# EAGLE design js220_fp_banana (EAGLE 9.6.2)
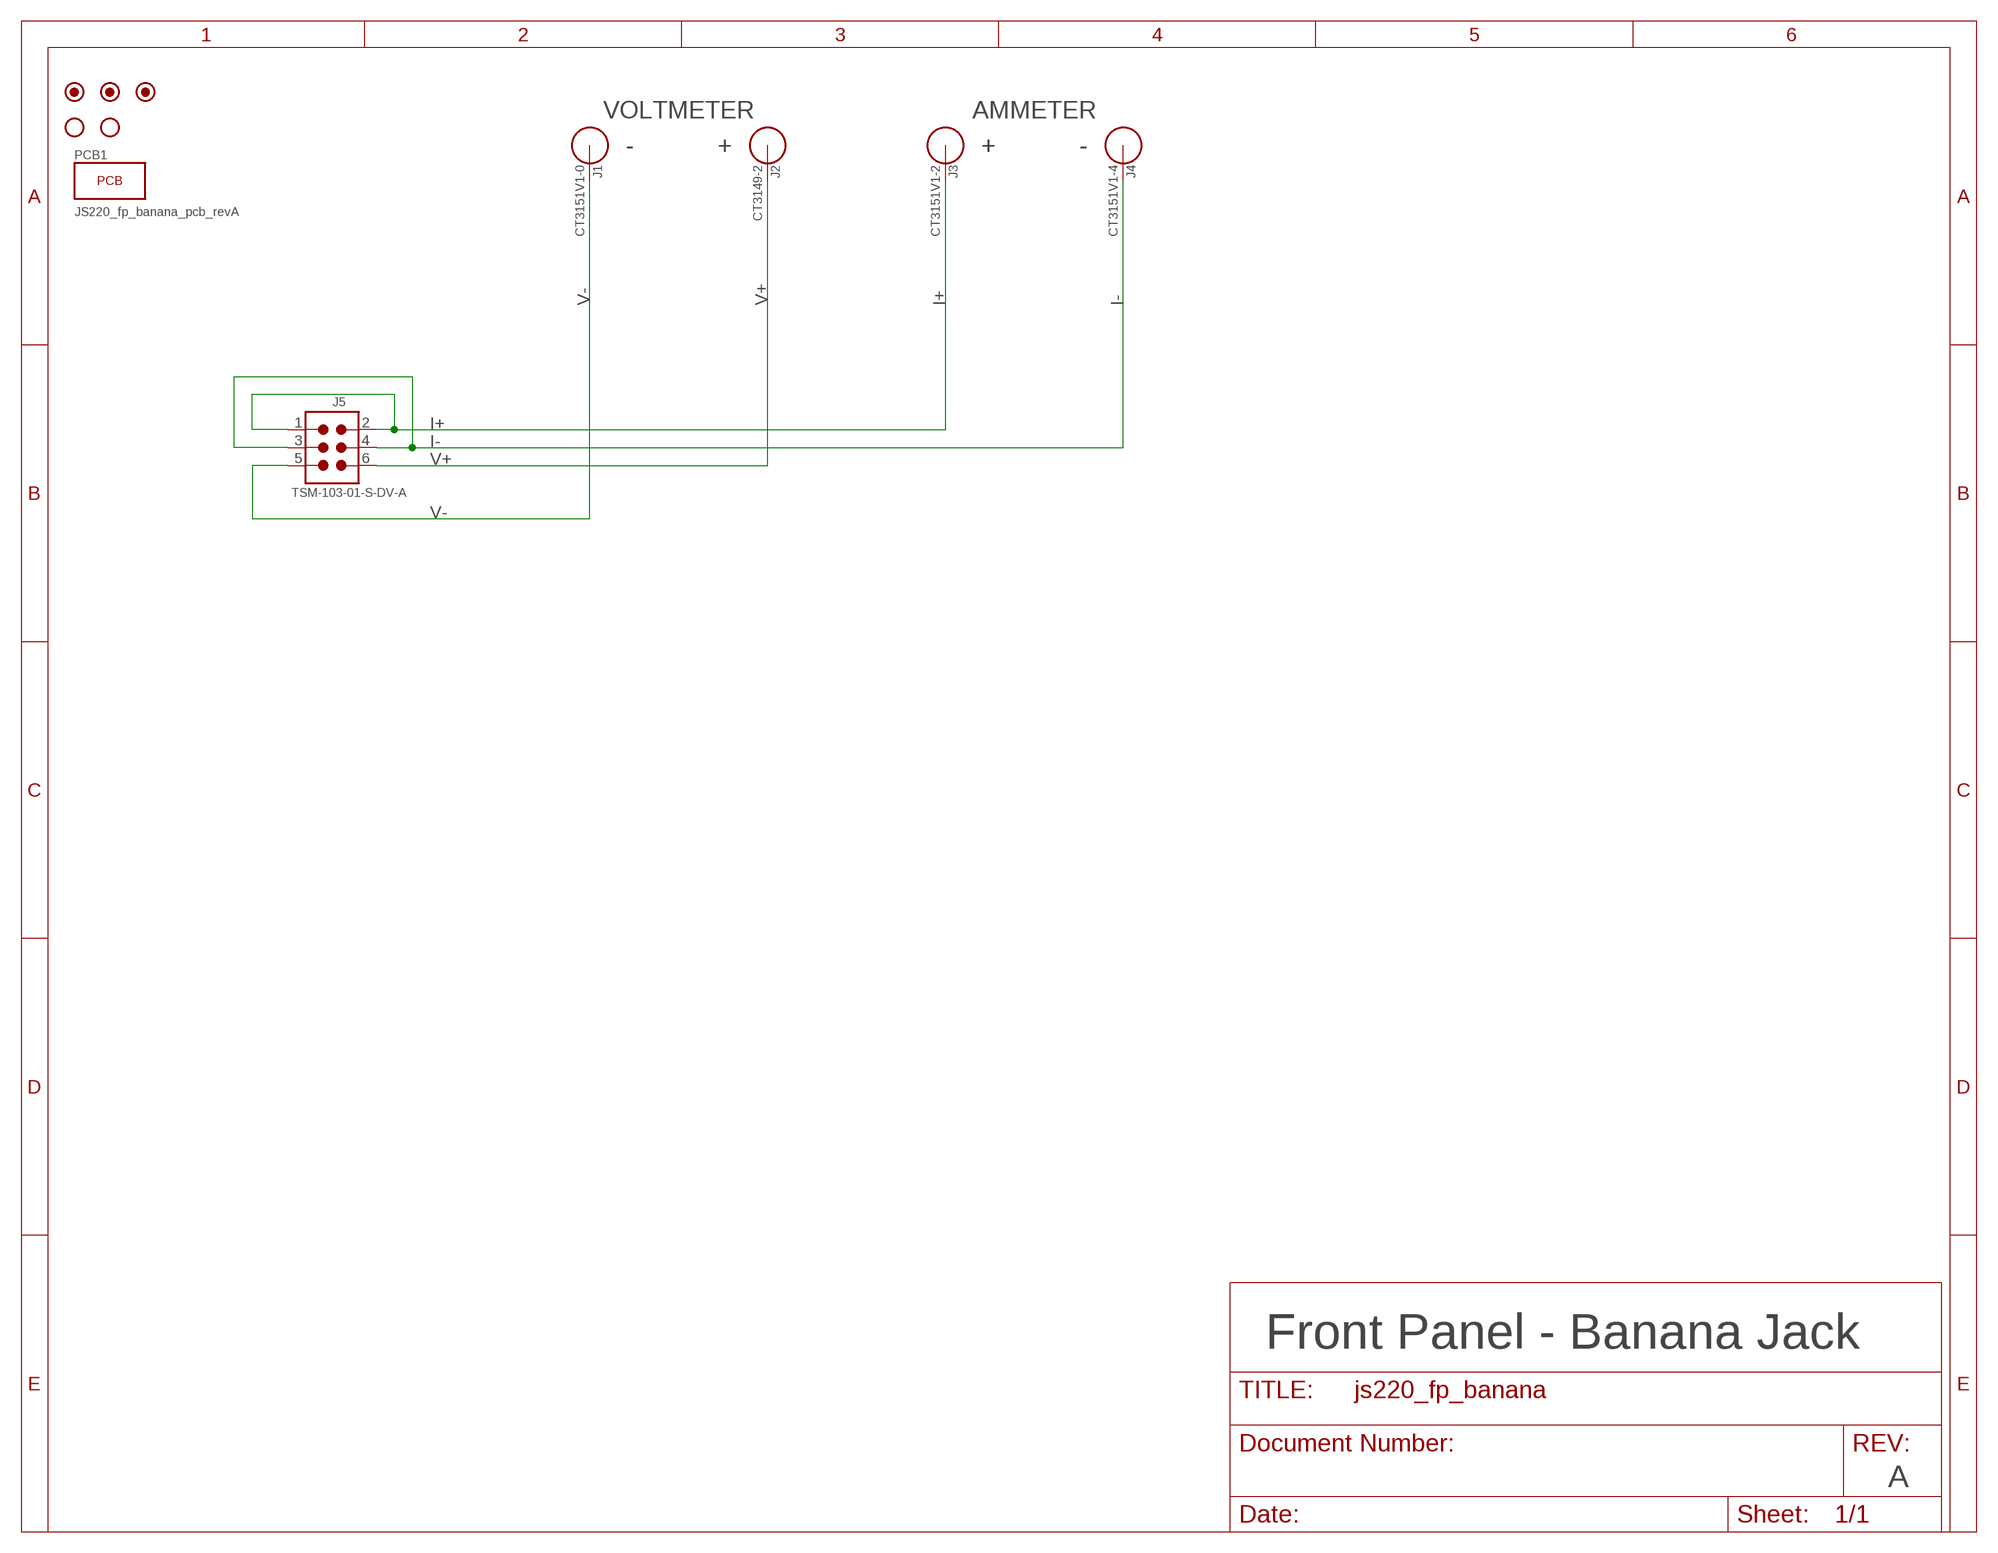
[diagram p0: schematic, sheet 1]
PCB1 (PCB): POPULATE: 1

## Parts
FUD1  FIDUCIAL_1MM  [FIDUCIAL_1MM_2MM]
FUD2  FIDUCIAL_1MM  [FIDUCIAL_1MM_2MM]
FUD3  FIDUCIAL_1MM  [FIDUCIAL_1MM_2MM]
H1  HOLE_#6_NORESTRICT  [HOLE_3.5MM_NORESTRICT]
H2  HOLE_#6_NORESTRICT  [HOLE_3.5MM_NORESTRICT]
J1  CT3151V1-0  BANANA-JACK_CT3151V  [CT3151V]
J2  CT3149-2  BANANA-JACK_CT3151V  [CT3151V]
J3  CT3151V1-2  BANANA-JACK_CT3151V  [CT3151V]
J4  CT3151V1-4  BANANA-JACK_CT3151V  [CT3151V]
J5  TSM-103-01-S-DV-A  CONN_0.1_3X2_MSA  [CONN_0.1_3X2_MSA]

## Nets
I+: J3.1 J3.2 J3.3 J3.4 J5.1 J5.2
I-: J4.1 J4.2 J4.3 J4.4 J5.3 J5.4
V+: J2.1 J2.2 J2.3 J2.4 J5.6
V-: J1.1 J1.2 J1.3 J1.4 J5.5

## Notes on the sheet
- VOLTMETER | AMMETER
- -            + | +            -
- Front Panel - Banana Jack
- A

## Library data of the parts
FUD1-FUD3 = jetperch:FIDUCIAL; POPULATE: 0
H1 H2 = jetperch:HOLE; POPULATE: 0
J1 = jetperch:BANANA-JACK; MPN: CT3151V1-0; POPULATE: 1
J2 J3 = jetperch:BANANA-JACK; MPN: CT3151V1-2; POPULATE: 1
J4 = jetperch:BANANA-JACK; MPN: CT3151V1-4; POPULATE: 1
J5 = jetperch:CONN_0.1_3X2; MPN: TSM-103-01-S-DV-A; POPULATE: 1

## Board
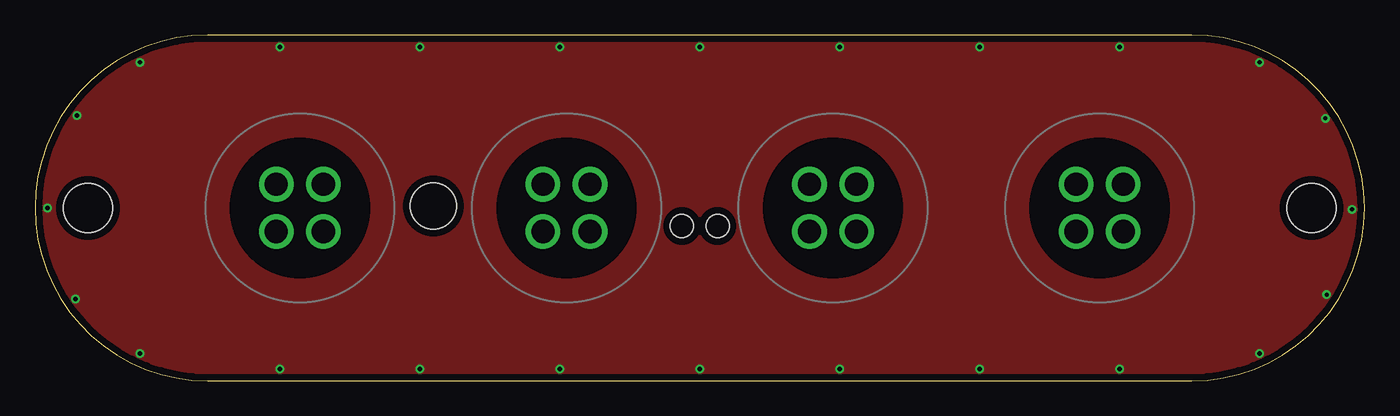
[diagram p1: board, top side]
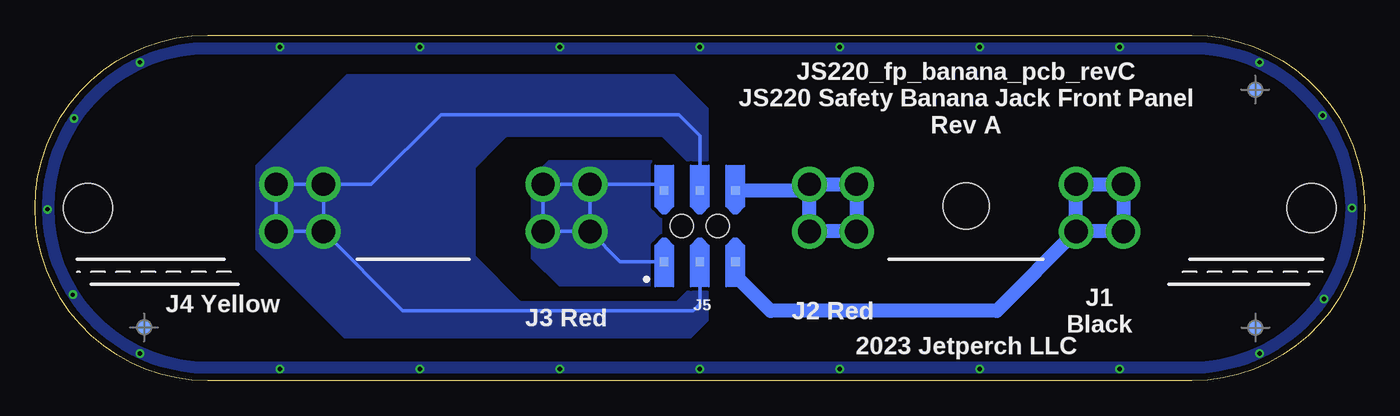
[diagram p2: board, bottom side, seen from below]

Size 95 x 24.7 mm. Coordinates in mm from the lower left corner, seen from the top.
Outline: 0,12.35 arc90 12.35,0 82.65,0 arc90 95,12.35 arc90 82.65,24.7 12.35,24.7 arc90 0,12.35
Copper layers (1*16): Top 0.035mm / dielectric 62mil / Bottom 0.035mm
Design rules "jetperch_2layer *": minimum track width 6mil, minimum drill 12mil, track to track 10mil, track to pad 10mil, pad to pad 10mil, via to via 10mil, smd to smd 0mil, copper to edge 20mil, drill to drill 10mil, minimum pad ring 6mil, minimum via ring 6mil, stop-mask expansion 0mil, vias tented up to drill 15mil, thermal gap 10mil
Holes 3.3 mm at 28.45,12.5
tRestrict: area 14.4,7.8 to 23.4,16.9; area 33.5,7.8 to 42.5,16.9; area 52.5,7.8 to 61.5,16.9; area 71.6,7.8 to 80.6,16.9

### Footprints (pad centres in the part's own frame; a part is rotated, then mirrored left to right if it is on the bottom)
FIDUCIAL_1MM_2MM = smd 1.016 x 1.016: P1 0,0
HOLE_3.5MM_NORESTRICT = hole 3.5: 0,0
CT3151V = drill 1.65: 1 -1.685,-1.685; 2 1.685,-1.685; 3 1.685,1.685; 4 -1.685,1.685
CONN_0.1_3X2_MSA = smd 0.635 x 0.635: 1 -2.54,-2.54; 2 -2.54,2.54; 3 0,-2.54; 4 0,2.54; 5 2.54,-2.54; 6 2.54,2.54 | hole 1.651: -1.27,0; 1.27,0

### Placement (x,y rotation side)
FUD1  7.79,3.79 0 bottom
FUD2  7.81,20.79 0 bottom
FUD3  87.21,3.81 0 bottom
H1  3.79,12.35 0 top
H2  91.21,12.35 0 top
J1  18.93,12.35 0 top
J2  37.98,12.35 0 top
J3  57.02,12.35 0 top
J4  76.08,12.35 0 top
J5  47.5,11.06 0 bottom

### Tracks (layer width: path | path; a pad name or v marks a point on that pad's centre or on a via)
CGND  (via drill 0.3)
  other vias: 47.5,23.85 57.5,23.85 67.5,23.85 77.5,23.85 37.5,23.85 27.5,23.85 17.5,23.85 17.5,0.85 27.5,0.85 37.5,0.85 47.5,0.85 57.5,0.85 67.5,0.85 77.5,0.85 87.5,22.75 87.5,1.95 94.1,12.25 92.2,18.75 92.3,6.15 7.5,1.95 7.5,22.75 3,18.95 0.9,12.35 2.9,5.85
  pour Top (isolate 0.508): 12.35,24.7 82.65,24.7 arc-90 95,12.35 arc-90 82.65,0 12.35,0 arc-90 0,12.35 arc-90
  pour Bottom (isolate 0.254): 48,0 12.35,0 arc-90 0,12.35 arc-90 12.35,24.7 47.5,24.7 47.5,23.45 12.35,23.45 arc90 1.25,12.35 arc90 12.35,1.25 47.5,1.25
  pour Bottom (isolate 0.254): 47.5,0 47.5,1.25 82.65,1.25 arc90 93.75,12.35 arc90 82.65,23.45 47.5,23.45 47.5,24.7 82.65,24.7 arc-90 95,12.35 arc-90 82.65,0
I+
  Bottom 0.254: J5.1 53.19,8.52 J3.1 | J5.2 50.48,14.04 J3.4 | J3.4 J3.3 J3.2 J3.1 | J3.1 J3.4
  pour Bottom (no thermals): 49.66,6.86 57.53,6.86 59.44,8.76 59.44,14.48 58.28,15.64 50.8,15.64 49.53,14.37 49.53,13.21 50.29,12.45 50.29,9.91 49.66,9.27
I-
  Bottom 0.254: J5.3 47.5,5.5 48,5 68.72,5 J4.1 | J5.4 47.5,17.5 49,19 66,19 70.97,14.04 J4.4 | J4.4 J4.3 J4.2 J4.1 | J4.1 J4.4
  pour Bottom (no thermals): 46.99,14.73 46.99,19.43 49.36,21.8 72.69,21.8 79.12,15.37 79.12,9.4 72.86,3.14 48.17,3.14 46.99,4.32 46.99,7.11 47.61,7.11 49.13,5.59 60.33,5.59 63.63,8.89 63.63,15.24 61.33,17.53 50.17,17.53 47.88,15.24 47.88,14.73
V+
  Bottom 1: J5.6 40.1,13.6 J2.3 | J2.3 J2.4 J2.1 J2.2 J2.3
V-
  Bottom 1: J1.2 J1.1 J1.4 J1.3 J1.2 | J1.2 26.27,5 42.44,5 44.96,7.52 J5.5

### Text on the board
bNames: JS220_fp_banana_pcb_revC / JS220 Safety Banana Jack Front Panel / Rev A | J4 Yellow | J1 / Black | J2 Red | J3 Red | 2023 Jetperch LLC
tStop: - | Voltage | + | + | Current | - | ±15V | ±3A | Sensor / Status | ±10A pulse | Isolated / ±48V max to USB ground
Measures: Sensor Status | 2x holes / 4x connectors
FabDoc1: All dimensions in millimeters | Place all markings on back (including pcb order number). / Add flammability rating marking on back, such as 94V-0. / The front-side surface is cosmetic - reject units with scratches and blemishes.